# EAGLE design PROJETOFINAL (EAGLE 4.16)
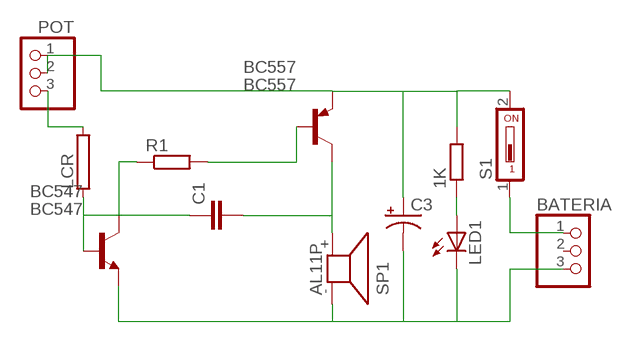
[diagram p0: schematic, sheet 1]

## Parts
1K  R-EU_0207/10  [0207/10]
BATERIA  PINHD-1X3  [1X03]
BC547  BC547  [TO92]
BC557  BC557  [TO92]
C1  C7.5/3  [C7.5B3]
C3  CPOL-USE3.5-8  [E3,5-8]
LCR  RKH206-8R  [KH206-8R]
LED1  LED5MM  [LED5MM]
POT  PINHD-1X3  [1X03]
R1  R-EU_0207/10  [0207/10]
S1  DS01  [DS-01]
SP1  AL11P  [AL11P]

## Nets
N$1: BC557.3(C) C1.2 SP1.+
N$3: BATERIA.3 BC547.1(E) C3.- LED1.K(C) SP1.-
N$4: BC557.2(B) R1.2
N$5: BC547.3(C) R1.1
N$6: BC547.2(B) C1.1 LCR.1
N$7: BATERIA.1 S1.1
N$8: LCR.2 POT.3
N$9: 1K.1 LED1.A
POT: 1K.2 BC557.1(E) C3.+ POT.1 POT.2 S1.2
Unconnected: BATERIA.2

## Library data of the parts
1K R1 = rcl:R-EU_: RESISTOR, European symbol
BATERIA POT = pinhead:PINHD-1X3: PIN HEADER
BC547 = transistor-npn:BC547*: NPN Transistor
BC557 = transistor-pnp:BC557: PNP Transistor
C1 = capacitor-wima:C: CAPACITOR naming: grid - package width
C3 = rcl:CPOL-US: POLARIZED CAPACITOR, American symbol
LCR = resistor-power:R: Power Resitor
LED1 = led:LED: LED OSRAM: - CHIPLED LG R971, LG N971, LY N971, LG Q971, LY Q971, LO R971, LY R971 LH N974, LH R974 LS Q976, LO Q976, LY Q976 LO Q996 - Hyper CHIPLED LW Q18S LB Q993, LB Q99A, LB R99A - SideLED LS A670, LO A670, LY A670, LG A670, LP A670 LB A673, LV A673, LT A673, LW A673 LH A674 LY A675 LS A676, LA A676, LO A676, LY A676, LW A676 LS A679, LY A679, LG A679 - Hyper Micro SIDELED® LS Y876, LA Y876, LO Y876, LY Y876 LT Y87S - SmartLED LW L88C, LW L88S LB L89C, LB L89S, LG L890 LS L89K, LO L89K, LY L89K LS L896, LA L896, LO L896, LY L896 - TOPLED LS T670, LO T670, LY T670, LG T670, LP T670 LSG T670, LSP T670, LSY T670, LOP T670, LYG T670 LG T671, LOG T671, LSG T671 LB T673, LV T673, LT T673, LW T673 LH T674 LS T676, LA T676, LO T676, LY T676, LB T676, LH T676, LSB T676, LW T676 LB T67C, LV T67C, LT T67C, LS T67K, LO T67K, LY T67K, LW E67C LS E67B, LA E67B, LO E67B, LY E67B, LB E67C, LV E67C, LT E67C LW T67C LS T679, LY T679, LG T679 LS T770, LO T770, LY T770, LG T770, LP T770 LB T773, LV T773, LT T773, LW T773 LH T774 LS E675, LA E675, LY E675, LS T675 LS T776, LA T776, LO T776, LY T776, LB T776 LHGB T686 LT T68C, LB T68C - Hyper Mini TOPLED® LB M676 - Mini TOPLED Santana® LG M470 LS M47K, LO M47K, LY M47K Source: http://www.osram.convergy.de - LUMILED® LXK2-PW12-R00, LXK2-PW12-S00, LXK2-PW14-U00, LXK2-PW14-V00 LXK2-PM12-R00, LXK2-PM12-S00, LXK2-PM14-U00 LXK2-PE12-Q00, LXK2-PE12-R00, LXK2-PE12-S00, LXK2-PE14-T00, LXK2-PE14-U00 LXK2-PB12-K00, LXK2-PB12-L00, LXK2-PB12-M00, LXK2-PB14-N00, LXK2-PB14-P00, LXK2-PB14-Q00 LXK2-PR12-L00, LXK2-PR12-M00, LXK2-PR14-Q00, LXK2-PR14-R00 LXK2-PD12-Q00, LXK2-PD12-R00, LXK2-PD12-S00 LXK2-PH12-R00, LXK2-PH12-S00 LXK2-PL12-P00, LXK2-PL12-Q00, LXK2-PL12-R00 Source: www.luxeon.com
S1 = switch-dil:DS01: DIL/CODE SWITCH
SP1 = buzzer:AL11P: SPEAKER Source: Buerklin

## Board
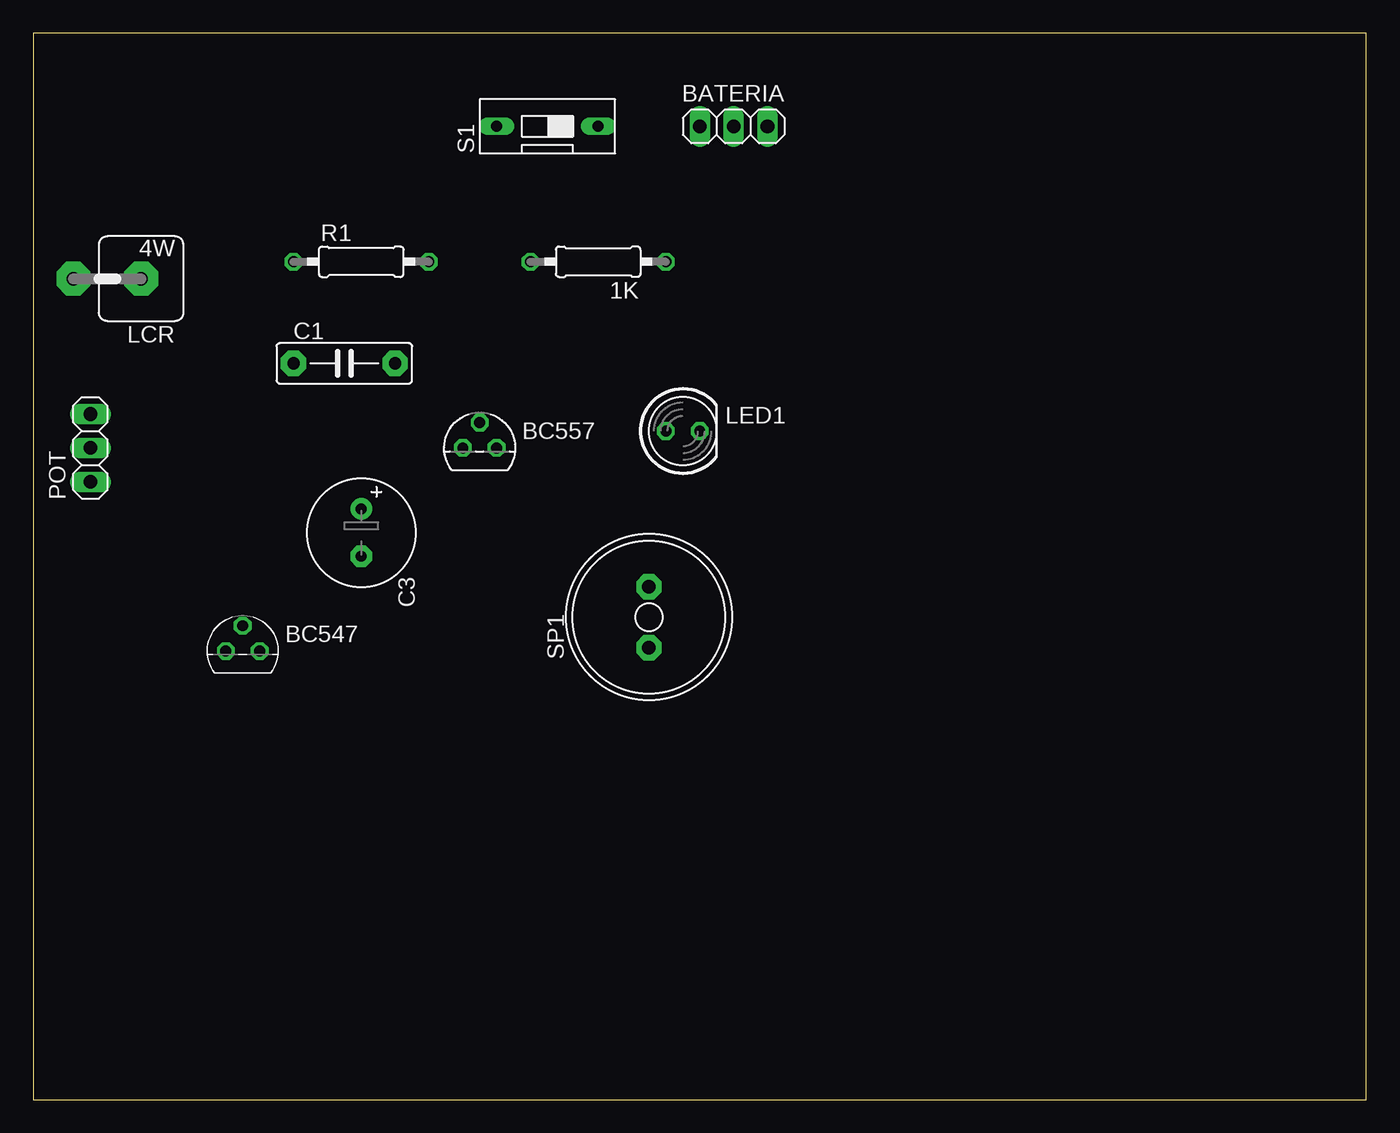
[diagram p1: board, top side]
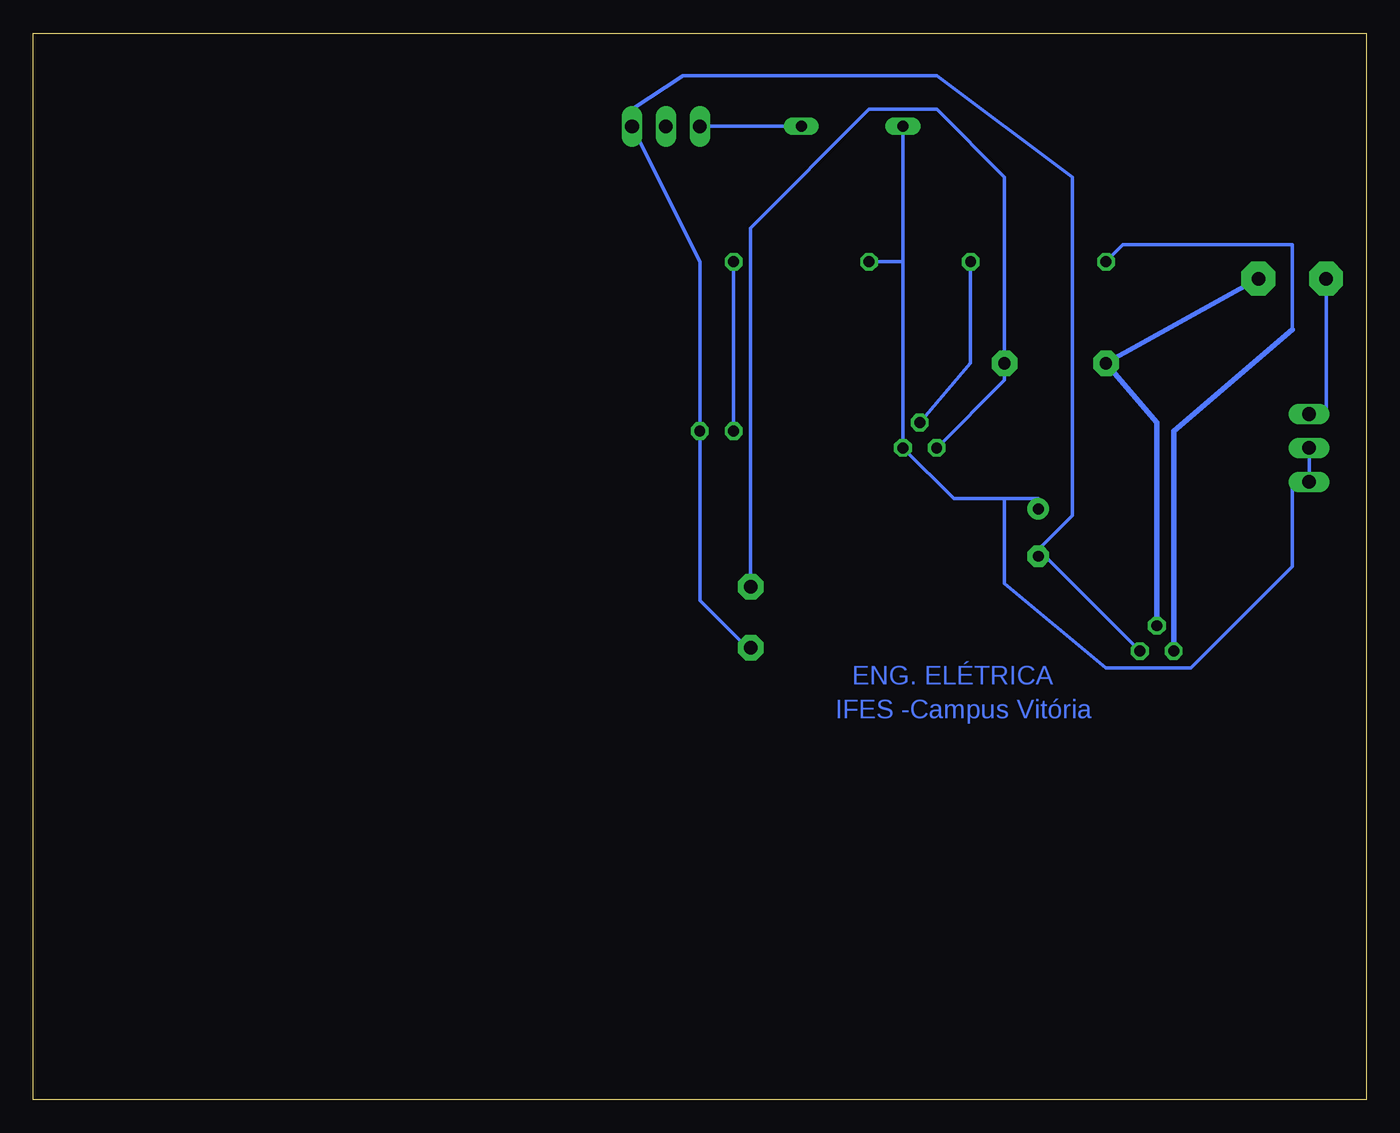
[diagram p2: board, bottom side, seen from below]

Size 100 x 80 mm. Coordinates in mm from the lower left corner, seen from the top.
Outline: 0,0 100,0 100,80 0,80 0,0
Copper layers (1*16): Top 0.035mm / dielectric 1.5mm / Bottom 0.035mm
Design rules "default": minimum track width 40mil, minimum drill 24mil, track to track 40mil, track to pad 8mil, pad to pad 8mil, via to via 8mil, smd to smd 8mil, copper to edge 40mil, drill to drill 10mil, minimum pad ring 10mil, minimum via ring 8mil, stop-mask expansion 4mil, vias tented up to drill 0mil, thermal gap 10mil

### Footprints (pad centres in the part's own frame; a part is rotated, then mirrored left to right if it is on the bottom)
0207/10 = drill 0.813 octagon: 1 -5.08,0; 2 5.08,0
1X03 = drill 1.016 long: 1 -2.54,0; 2 0,0; 3 2.54,0
TO92 = drill 0.813 octagon: 1 1.27,0; 2 0,1.905; 3 -1.27,0
C7.5B3 = drill 0.914 pad 1.905 octagon: 1 -3.81,0; 2 3.81,0
E3,5-8 = drill 0.813 pad 1.6 round: + -1.778,0 | drill 0.813 pad 1.6 octagon: - 1.778,0
KH206-8R = drill 1.016 pad 2.54 octagon: 1 -2.54,0; 2 2.54,0
LED5MM = drill 0.813 octagon: A -1.27,0; K 1.27,0
DS-01 = drill 0.813 long: 1 0,-3.81; 2 0,3.81
AL11P = drill 1.016 pad 1.905 octagon: + 2.286,0; - -2.286,0

### Placement (x,y rotation side)
1K  42.38,62.86 180 top
BATERIA  52.54,73.02 0 top
BC547  15.71,33.65 0 top
BC557  33.49,48.89 0 top
C1  23.33,55.24 0 top
C3  24.6,42.54 270 top
LCR  5.55,61.59 180 top
LED1  48.73,50.16 0 top
POT  4.28,48.89 90 top
R1  24.6,62.86 0 top
S1  38.57,73.02 90 top
SP1  46.19,36.19 90 top

### Tracks (layer width: path | path; a pad name or v marks a point on that pad's centre or on a via)
N$1
  Bottom 0.254: BC557.3 27.14,53.97 C1.2 27.14,69.21 32.22,74.29 37.3,74.29 46.19,65.4 SP1.+
N$3
  Bottom 0.254: BC547.1 24.6,41.27 | SP1.- 46.19,33.65 50,37.46 LED1.K 50,62.86 BATERIA.3 55.08,74.29 51.27,76.83 32.22,76.83 22.06,69.21 22.06,43.81 24.6,41.27 | 24.6,41.27 C3.-
N$4
  Bottom 0.254: R1.2 29.68,55.24 BC557.2
N$5
  Bottom 0.254: 5.55,57.78 5.55,64.13 18.25,64.13 R1.1
  Bottom 0.406: BC547.3 14.44,50.16 5.55,57.78
N$6
  Bottom 0.406: LCR.1 C1.1 15.71,50.8 BC547.2
N$7
  Bottom 0.254: S1.1 BATERIA.1
N$8
  Bottom 0.254: LCR.2 3.01,51.43 POT.3
N$9
  Bottom 0.254: LED1.A 1K.1
POT
  Bottom 0.254: POT.2 POT.1 5.55,46.35 5.55,40 13.17,32.38 19.52,32.38 27.14,38.73 27.14,45.08 | 34.76,62.86 S1.2 | 34.76,62.86 BC557.1 30.95,45.08 27.14,45.08 | 34.76,62.86 1K.2 | 27.14,45.08 24.6,45.08 C3.+

### Text on the board
Bottom: ENG. ELÉTRICA | IFES -Campus Vitória